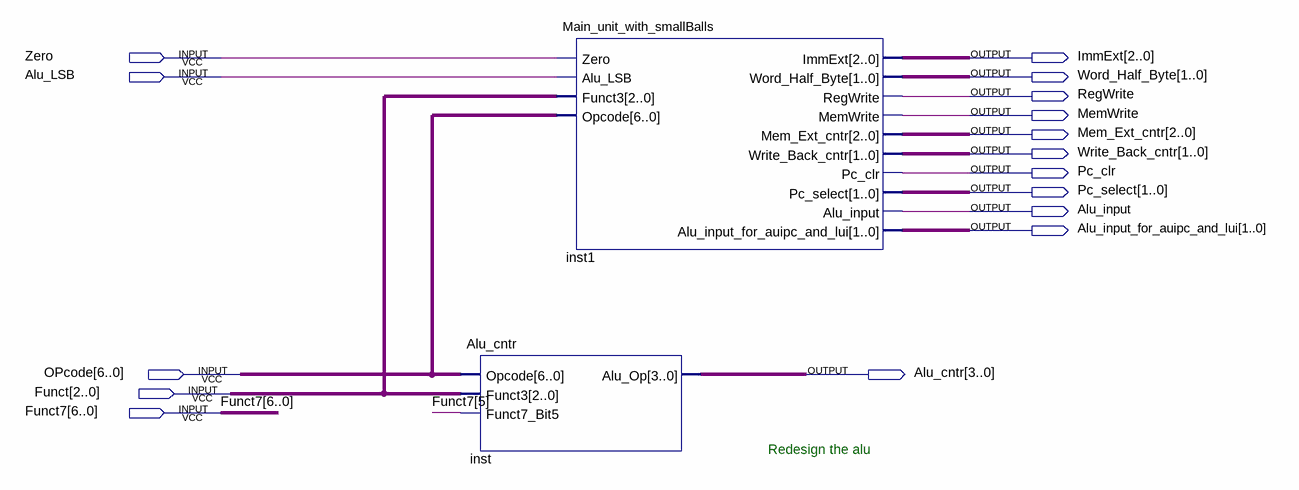
[diagram p0: schematic sheet]
// Quartus schematic Control_unit_with_big_balls.bdf as structural Verilog: 2 symbols, 16 pins
module Control_unit_with_big_balls (
  input  Zero,
  input  Alu_LSB,
  input  [6:0] OPcode,
  input  [2:0] Funct,
  input  [6:0] Funct7,
  output [2:0] ImmExt,
  output [1:0] Word_Half_Byte,
  output RegWrite,
  output MemWrite,
  output [2:0] Mem_Ext_cntr,
  output [1:0] Write_Back_cntr,
  output Pc_clr,
  output [1:0] Pc_select,
  output Alu_input,
  output [1:0] Alu_input_for_auipc_and_lui,
  output [3:0] Alu_cntr
);

  Alu_cntr inst (.Opcode(OPcode), .Funct3(Funct), .Funct7_Bit5(Funct7[5]), .Alu_Op(Alu_cntr));
  Main_unit_with_smallBalls inst1 (
    .Zero(Zero), .Alu_LSB(Alu_LSB), .Funct3(Funct), .Opcode(OPcode), .ImmExt(ImmExt),
    .Word_Half_Byte(Word_Half_Byte), .RegWrite(RegWrite), .MemWrite(MemWrite), .Mem_Ext_cntr(Mem_Ext_cntr),
    .Write_Back_cntr(Write_Back_cntr), .Pc_clr(Pc_clr), .Pc_select(Pc_select), .Alu_input(Alu_input),
    .Alu_input_for_auipc_and_lui(Alu_input_for_auipc_and_lui));

  // Notes on the sheet:
  //   Redesign the alu
endmodule
